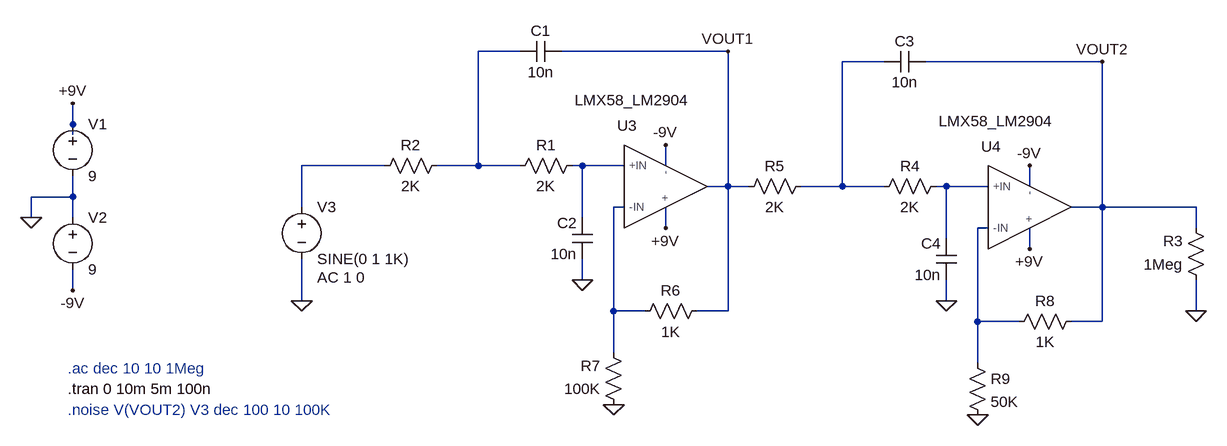
[diagram p0: schematic Sallen_Key_Test.asc]
Sallen_Key_Test.asc, the LTspice schematic file:
Version 4
SHEET 1 1160 776
WIRE 48 -16 -16 -16
WIRE 368 -16 112 -16
WIRE 608 0 544 0
WIRE 944 0 672 0
WIRE -640 96 -640 64
WIRE -640 112 -640 96
WIRE -160 160 -288 160
WIRE -16 160 -16 -16
WIRE -16 160 -80 160
WIRE 48 160 -16 160
WIRE 144 160 128 160
WIRE 208 160 144 160
WIRE 272 160 272 128
WIRE 368 192 368 -16
WIRE 368 192 336 192
WIRE 400 192 368 192
WIRE 544 192 544 0
WIRE 544 192 480 192
WIRE 608 192 544 192
WIRE 704 192 688 192
WIRE 768 192 704 192
WIRE 832 192 832 160
WIRE -640 208 -640 176
WIRE -640 208 -704 208
WIRE -288 224 -288 160
WIRE 208 224 192 224
WIRE 944 224 944 0
WIRE 944 224 896 224
WIRE 1088 224 944 224
WIRE -704 240 -704 208
WIRE -640 240 -640 208
WIRE 144 240 144 160
WIRE 272 256 272 224
WIRE 768 256 752 256
WIRE 1088 256 1088 224
WIRE 704 272 704 192
WIRE 832 288 832 256
WIRE 144 336 144 304
WIRE -640 352 -640 320
WIRE -288 368 -288 304
WIRE 704 368 704 336
WIRE 192 384 192 224
WIRE 240 384 192 384
WIRE 368 384 368 192
WIRE 368 384 320 384
WIRE 1088 384 1088 336
WIRE 752 400 752 256
WIRE 816 400 752 400
WIRE 944 400 944 224
WIRE 944 400 896 400
WIRE 192 448 192 384
WIRE 752 464 752 400
FLAG 272 256 +9V
FLAG 272 128 -9V
FLAG -704 240 0
FLAG -640 352 -9V
FLAG -640 64 +9V
FLAG 144 336 0
FLAG -288 368 0
FLAG 832 288 +9V
FLAG 832 160 -9V
FLAG 704 368 0
FLAG 944 0 VOUT2
FLAG 1088 384 0
FLAG 192 528 0
FLAG 752 544 0
FLAG 368 -16 VOUT1
SYMBOL cap 112 -32 R90
WINDOW 0 0 32 VBottom 2
WINDOW 3 32 32 VTop 2
SYMATTR InstName C1
SYMATTR Value 10n
SYMATTR SpiceLine V=25 Irms=0 Rser=0 Lser=0 mfg="Murata" pn="GCM0335C1E100JA16" type="C0G"
SYMBOL cap 160 304 R180
WINDOW 0 24 56 Left 2
WINDOW 3 24 8 Left 2
SYMATTR InstName C2
SYMATTR Value 10n
SYMATTR SpiceLine V=25 Irms=0 Rser=0 Lser=0 mfg="Murata" pn="GCM0335C1E100JA16" type="C0G"
SYMBOL res 144 144 R90
WINDOW 0 0 56 VBottom 2
WINDOW 3 32 56 VTop 2
SYMATTR InstName R1
SYMATTR Value 2K
SYMBOL res -64 144 R90
WINDOW 0 0 56 VBottom 2
WINDOW 3 32 56 VTop 2
SYMATTR InstName R2
SYMATTR Value 2K
SYMBOL voltage -640 80 R0
WINDOW 123 0 0 Left 0
WINDOW 39 0 0 Left 0
SYMATTR InstName V1
SYMATTR Value 9
SYMBOL voltage -640 224 R0
SYMATTR InstName V2
SYMATTR Value 9
SYMBOL voltage -288 208 R0
WINDOW 123 24 124 Left 2
WINDOW 39 0 0 Left 0
SYMATTR Value2 AC 1 0
SYMATTR InstName V3
SYMATTR Value SINE(0 1 1K)
SYMBOL cap 672 -16 R90
WINDOW 0 0 32 VBottom 2
WINDOW 3 32 32 VTop 2
SYMATTR InstName C3
SYMATTR Value 10n
SYMATTR SpiceLine V=25 Irms=0 Rser=0 Lser=0 mfg="Murata" pn="GCM0335C1E100JA16" type="C0G"
SYMBOL cap 720 336 R180
WINDOW 0 24 56 Left 2
WINDOW 3 24 8 Left 2
SYMATTR InstName C4
SYMATTR Value 10n
SYMATTR SpiceLine V=25 Irms=0 Rser=0 Lser=0 mfg="Murata" pn="GCM0335C1E100JA16" type="C0G"
SYMBOL res 704 176 R90
WINDOW 0 0 56 VBottom 2
WINDOW 3 32 56 VTop 2
SYMATTR InstName R4
SYMATTR Value 2K
SYMBOL res 496 176 R90
WINDOW 0 0 56 VBottom 2
WINDOW 3 32 56 VTop 2
SYMATTR InstName R5
SYMATTR Value 2K
SYMBOL res 1104 352 R180
WINDOW 0 36 76 Left 2
WINDOW 3 36 40 Left 2
SYMATTR InstName R3
SYMATTR Value 1Meg
SYMBOL LMX58_LM2904 240 192 M180
WINDOW 0 -27 109 Bottom 2
WINDOW 3 -19 117 Top 2
SYMATTR InstName U3
SYMBOL LMX58_LM2904 800 224 M180
WINDOW 0 -27 109 Bottom 2
WINDOW 3 -19 117 Top 2
SYMATTR InstName U4
SYMBOL res 336 368 R90
WINDOW 0 0 56 VBottom 2
WINDOW 3 32 56 VTop 2
SYMATTR InstName R6
SYMATTR Value 1K
SYMBOL res 208 544 R180
WINDOW 0 36 76 Left 2
WINDOW 3 36 40 Left 2
SYMATTR InstName R7
SYMATTR Value 100K
SYMBOL res 800 416 R270
WINDOW 0 32 56 VTop 2
WINDOW 3 0 56 VBottom 2
SYMATTR InstName R8
SYMATTR Value 1K
SYMBOL res 736 448 R0
SYMATTR InstName R9
SYMATTR Value 50K
TEXT -648 472 Left 2 ;.ac dec 10 10 1Meg
TEXT -648 504 Left 2 !.tran 0 10m 5m 100n
TEXT -648 536 Left 2 ;.noise V(VOUT2) V3 dec 100 10 100K

The netlist it stands for:
* Sallen_Key_Test.asc
C1 VOUT1 N001 10n V=25 Irms=0 Rser=0 Lser=0 mfg="Murata" pn="GCM0335C1E100JA16" type="C0G"
C2 0 N004 10n V=25 Irms=0 Rser=0 Lser=0 mfg="Murata" pn="GCM0335C1E100JA16" type="C0G"
R1 N004 N001 2K
R2 N001 N003 2K
V1 +9V 0 9
V2 0 -9V 9
V3 N003 0 SINE(0 1 1K) AC 1 0
C3 VOUT2 N002 10n V=25 Irms=0 Rser=0 Lser=0 mfg="Murata" pn="GCM0335C1E100JA16" type="C0G"
C4 0 N005 10n V=25 Irms=0 Rser=0 Lser=0 mfg="Murata" pn="GCM0335C1E100JA16" type="C0G"
R4 N005 N002 2K
R5 N002 VOUT1 2K
R3 0 VOUT2 1Meg
XU3 N004 N006 +9V -9V VOUT1 LMX58_LM2904  ; pins +IN -IN + - ?
XU4 N005 N007 +9V -9V VOUT2 LMX58_LM2904  ; pins +IN -IN + - ?
R6 VOUT1 N006 1K
R7 0 N006 100K
R8 N007 VOUT2 1K
R9 N007 0 50K
* .ac dec 10 10 1Meg
.tran 0 10m 5m 100n
* .noise V(VOUT2) V3 dec 100 10 100K
.lib D:\git-repos\LTSpice-Projects\lm358\lmx58_lm2904.lib
.backanno
.end